# EAGLE design Spring_Rev2_expander (EAGLE 7.7.0)
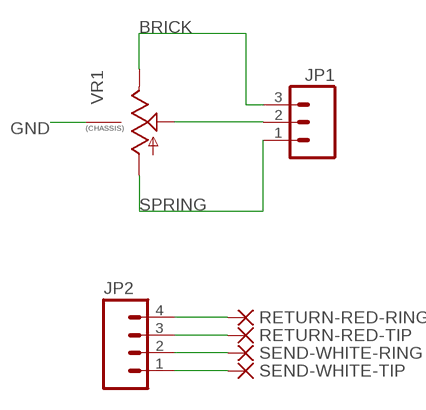
[diagram p0: schematic, sheet 1]

## Parts
JP1  M03POLAR_LOCK  [MOLEX-1X3_LOCK]
JP2  M04POLAR_LOCK  [MOLEX-1X4_LOCK]
RETURN-RED-RING  PAD-1.00-2.00  [PAD-1.00-2.00]
RETURN-RED-TIP  PAD-1.00-2.00  [PAD-1.00-2.00]
SEND-WHITE-RING  PAD-1.00-2.00  [PAD-1.00-2.00]
SEND-WHITE-TIP  PAD-1.00-2.00  [PAD-1.00-2.00]
VR1  9MM_SNAP-IN_POT_CHASSIS  [9MM_SNAP-IN_POT]

## Nets
BRICK: JP1.3 VR1.3(E)
GND: JP2.4 RETURN-RED-RING.1(P) VR1.CHASSIS1 VR1.CHASSIS2
OUT: JP1.2 VR1.2(S)
R+: JP2.3 RETURN-RED-TIP.1(P)
S+: JP2.1 SEND-WHITE-TIP.1(P)
S-: JP2.2 SEND-WHITE-RING.1(P)
SPRING: JP1.1 VR1.1(A)

## Library data of the parts
JP1 = SparkFun-Connectors:M03: Header 3 Standard 3-pin 0.1" header. Use with straight break away headers (SKU : PRT-00116), right angle break away headers (PRT-00553), swiss pins (PRT-00743), machine pins (PRT-00117), and female headers (PRT-00115). Molex polarized connector foot print use with SKU : PRT-08232 with associated crimp pins and housings.
JP2 = SparkFun-Connectors:M04: Header 4 Standard 4-pin 0.1" header. Use with straight break away headers (SKU : PRT-00116), right angle break away headers (PRT-00553), swiss pins (PRT-00743), machine pins (PRT-00117), and female headers (PRT-00115). Molex polarized connector foot print use with SKU : PRT-08231 with associated crimp pins and housings. 1MM SMD Version SKU: PRT-10208
RETURN-RED-RING RETURN-RED-TIP SEND-WHITE-RING SEND-WHITE-TIP = we-rcl:PAD: Pads
VR1 = MusicThingModular:9MM_SNAP-IN_POT_CHASSIS: 9mm vertical snap-in pot, Alpha / Panasonic style, with a connection to the metal chassis for grounding

## Board
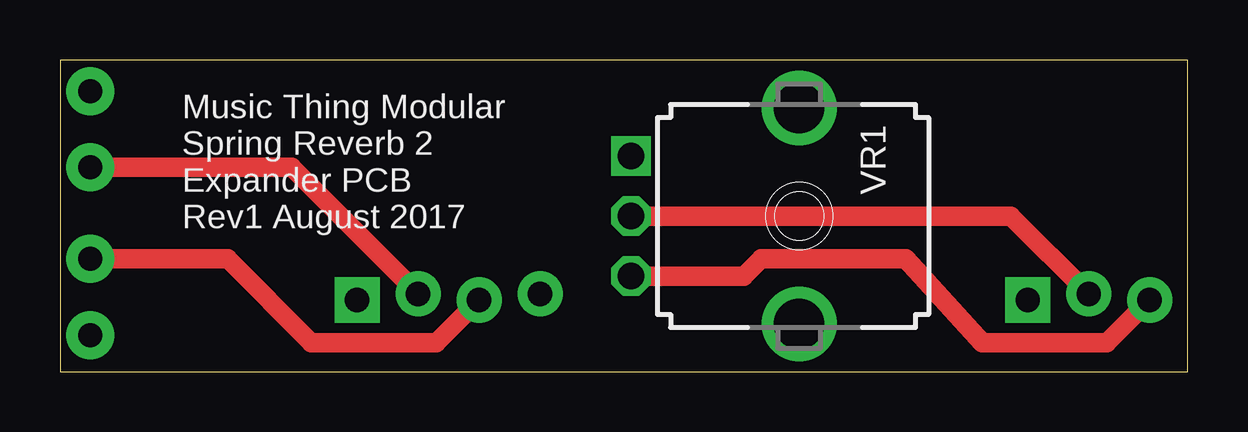
[diagram p1: board, top side]
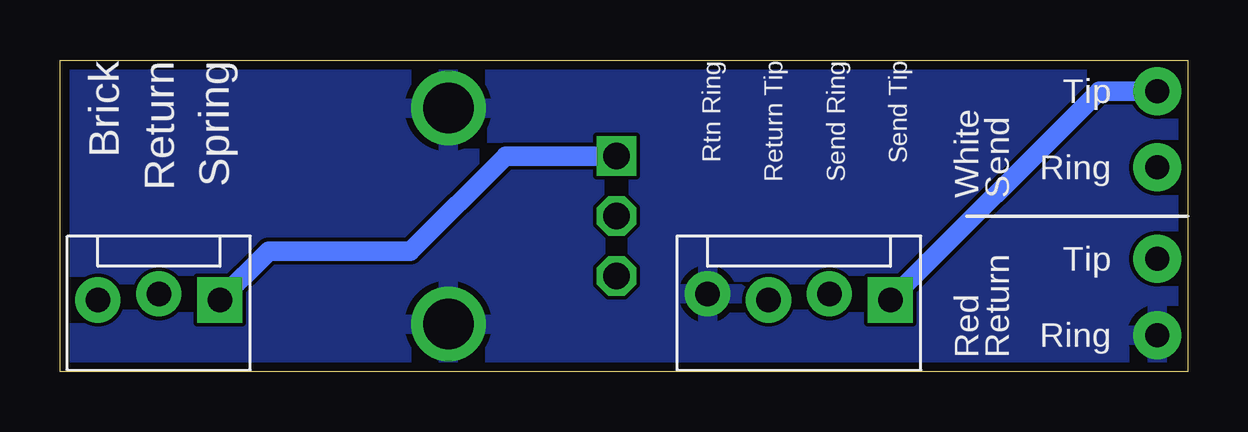
[diagram p2: board, bottom side, seen from below]

Size 46.98 x 12.98 mm. Coordinates in mm from the lower left corner, seen from the top.
Outline: 0,12.98 0,0 46.98,0 46.98,12.98 0,12.98
Copper layers (1*16): Top 0.0356mm / dielectric 1.5011mm / Bottom 0.0356mm
Design rules "oshpark-2layer": minimum track width 6mil, minimum drill 13mil, track to track 6mil, track to pad 6mil, pad to pad 6mil, via to via 6mil, smd to smd 6mil, copper to edge 15mil, drill to drill 6mil, minimum pad ring 7mil, minimum via ring 7mil, stop-mask expansion 2.5mil, vias tented up to drill 0mil, thermal gap 10mil

### Footprints (pad centres in the part's own frame; a part is rotated, then mirrored left to right if it is on the bottom)
MOLEX-1X3_LOCK = drill 1.016 pad 1.88 square: 1 0,0.127 | drill 1.016 pad 1.88: 2 2.54,-0.127; 3 5.08,0.127
MOLEX-1X4_LOCK = drill 1.016 pad 1.88 square: 1 0,0.127 | drill 1.016 pad 1.88: 2 2.54,-0.127; 3 5.08,0.127; 4 7.62,-0.127
PAD-1.00-2.00 = drill 1 pad 2: 1 0,0
9MM_SNAP-IN_POT = drill 1.1 square: 1 -2.5,-7 | drill 1.1 octagon: 2 0,-7; 3 2.5,-7 | drill 2.1 pad 2.794: CHASSIS1 -4.5,0; CHASSIS2 4.5,0

### Placement (x,y rotation side)
JP1  40.32,3.11 180 bottom
JP2  12.38,3.11 180 bottom
RETURN-RED-RING  1.27,1.52 0 bottom
RETURN-RED-TIP  1.27,4.7 0 bottom
SEND-WHITE-RING  1.27,8.51 0 bottom
SEND-WHITE-TIP  1.27,11.68 0 bottom
VR1  30.8,6.48 270 top

### Tracks (layer width: path | path; a pad name or v marks a point on that pad's centre or on a via)
BRICK
  Top 0.813: VR1.3 28.5,3.98 29.21,4.7 35.24,4.7 38.42,1.2 43.62,1.2 JP1.3
GND
  pour Bottom: 0,14.22 48.58,14.22 48.58,-1.02 0,-1.02
OUT
  Top 0.813: VR1.2 39.62,6.48 JP1.2
R+
  Top 0.813: RETURN-RED-TIP.1 6.99,4.7 10.48,1.2 15.68,1.2 JP2.3
S+
  Bottom 0.813: SEND-WHITE-TIP.1 3.68,11.68 JP2.1
S-
  Top 0.813: SEND-WHITE-RING.1 9.65,8.51 JP2.2
SPRING
  Bottom 0.813: VR1.1 28.42,8.98 32.38,5.01 38.29,5.01 JP1.1

### Text on the board
tPlace: Music Thing Modular / Spring Reverb 2 / Expander PCB / Rev1 August 2017
bPlace: Rtn Ring / Return Tip / Send Ring / Send Tip | Brick / Return / Spring | Tip | Ring | Send | White | Tip | Ring | Return | Red